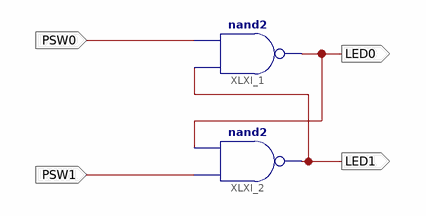
[diagram p0: schematic sheet 1]
// Xilinx ISE schematic lab6_1_srlatch.sch (spartan3) as structural Verilog: 2 symbols, 4 ports
module lab6_1_srlatch (
  input  PSW0,
  input  PSW1,
  output LED1,
  output LED0
);

  nand XLXI_1 (LED0, LED1, PSW0);
  nand XLXI_2 (LED1, PSW1, LED0);
endmodule
